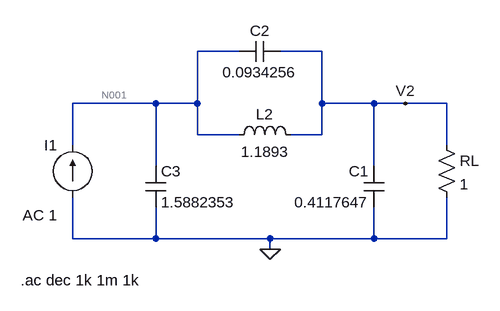
[diagram p0: schematic Ej2.asc]
Ej2.asc, the LTspice schematic file:
Version 4
SHEET 1 880 680
WIRE 192 32 128 32
WIRE 320 32 256 32
WIRE 64 112 -64 112
WIRE 128 112 128 32
WIRE 128 112 64 112
WIRE 320 112 320 32
WIRE 400 112 320 112
WIRE 448 112 400 112
WIRE 512 112 448 112
WIRE 128 160 128 112
WIRE 192 160 128 160
WIRE 320 160 320 112
WIRE 320 160 272 160
WIRE -64 176 -64 112
WIRE 512 176 512 112
WIRE 64 208 64 112
WIRE 400 208 400 112
WIRE -64 320 -64 256
WIRE 64 320 64 272
WIRE 64 320 -64 320
WIRE 240 320 64 320
WIRE 400 320 400 272
WIRE 400 320 240 320
WIRE 512 320 512 256
WIRE 512 320 400 320
WIRE 240 336 240 320
FLAG 448 112 V2
FLAG 240 336 0
SYMBOL cap 48 208 R0
SYMATTR InstName C3
SYMATTR Value 1.5882353
SYMBOL cap 256 16 R90
WINDOW 0 0 32 VBottom 2
WINDOW 3 32 32 VTop 2
SYMATTR InstName C2
SYMATTR Value 0.0934256
SYMBOL cap 416 272 R180
WINDOW 0 24 56 Left 2
WINDOW 3 24 8 Left 2
SYMATTR InstName C1
SYMATTR Value 0.4117647
SYMBOL res 496 160 R0
SYMATTR InstName RL
SYMATTR Value 1
SYMBOL current -64 256 R180
WINDOW 0 24 80 Left 2
WINDOW 3 24 0 Left 2
WINDOW 123 24 -28 Left 2
WINDOW 39 0 0 Left 0
SYMATTR InstName I1
SYMATTR Value ""
SYMATTR Value2 AC 1
SYMBOL ind 176 176 R270
WINDOW 0 32 56 VTop 2
WINDOW 3 5 56 VBottom 2
SYMATTR InstName L2
SYMATTR Value 1.1893
TEXT -144 384 Left 2 !.ac dec 1k 1m 1k

The netlist it stands for:
* Ej2.asc
C3 N001 0 1.5882353
C2 V2 N001 0.0934256
C1 0 V2 0.4117647
RL V2 0 1
I1 0 N001 AC 1
L2 N001 V2 1.1893
.ac dec 1k 1m 1k
.backanno
.end

* Results of the author's LTspice run, read from the files saved beside the schematic
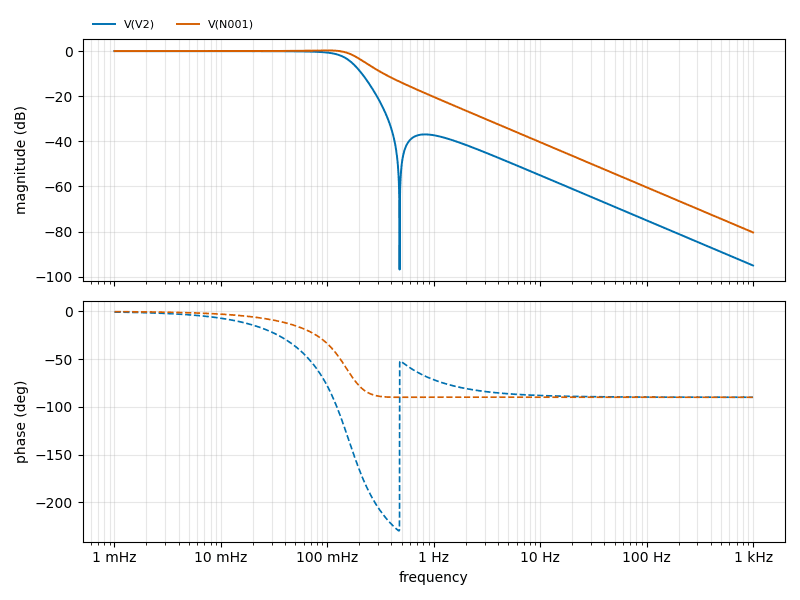
[diagram p1: AC Analysis of Ej2.asc, plotted from the saved traces]
* AC Analysis, 1 run:
*   V(V2): -0.00 dB at 1 mHz, -95.05 dB at 1 kHz, peak -0.00 dB at 1 mHz, 3 dB below the peak at 147.5 mHz
*   V(N001): 0.01 dB at 1 mHz, -80.39 dB at 1 kHz, peak 0.31 dB at 99.31 mHz, 3 dB below the peak at 188.1 mHz